# EAGLE schematic EXCISS Mainboard (EAGLE 7.7.0)

## Sheet 1 of 5
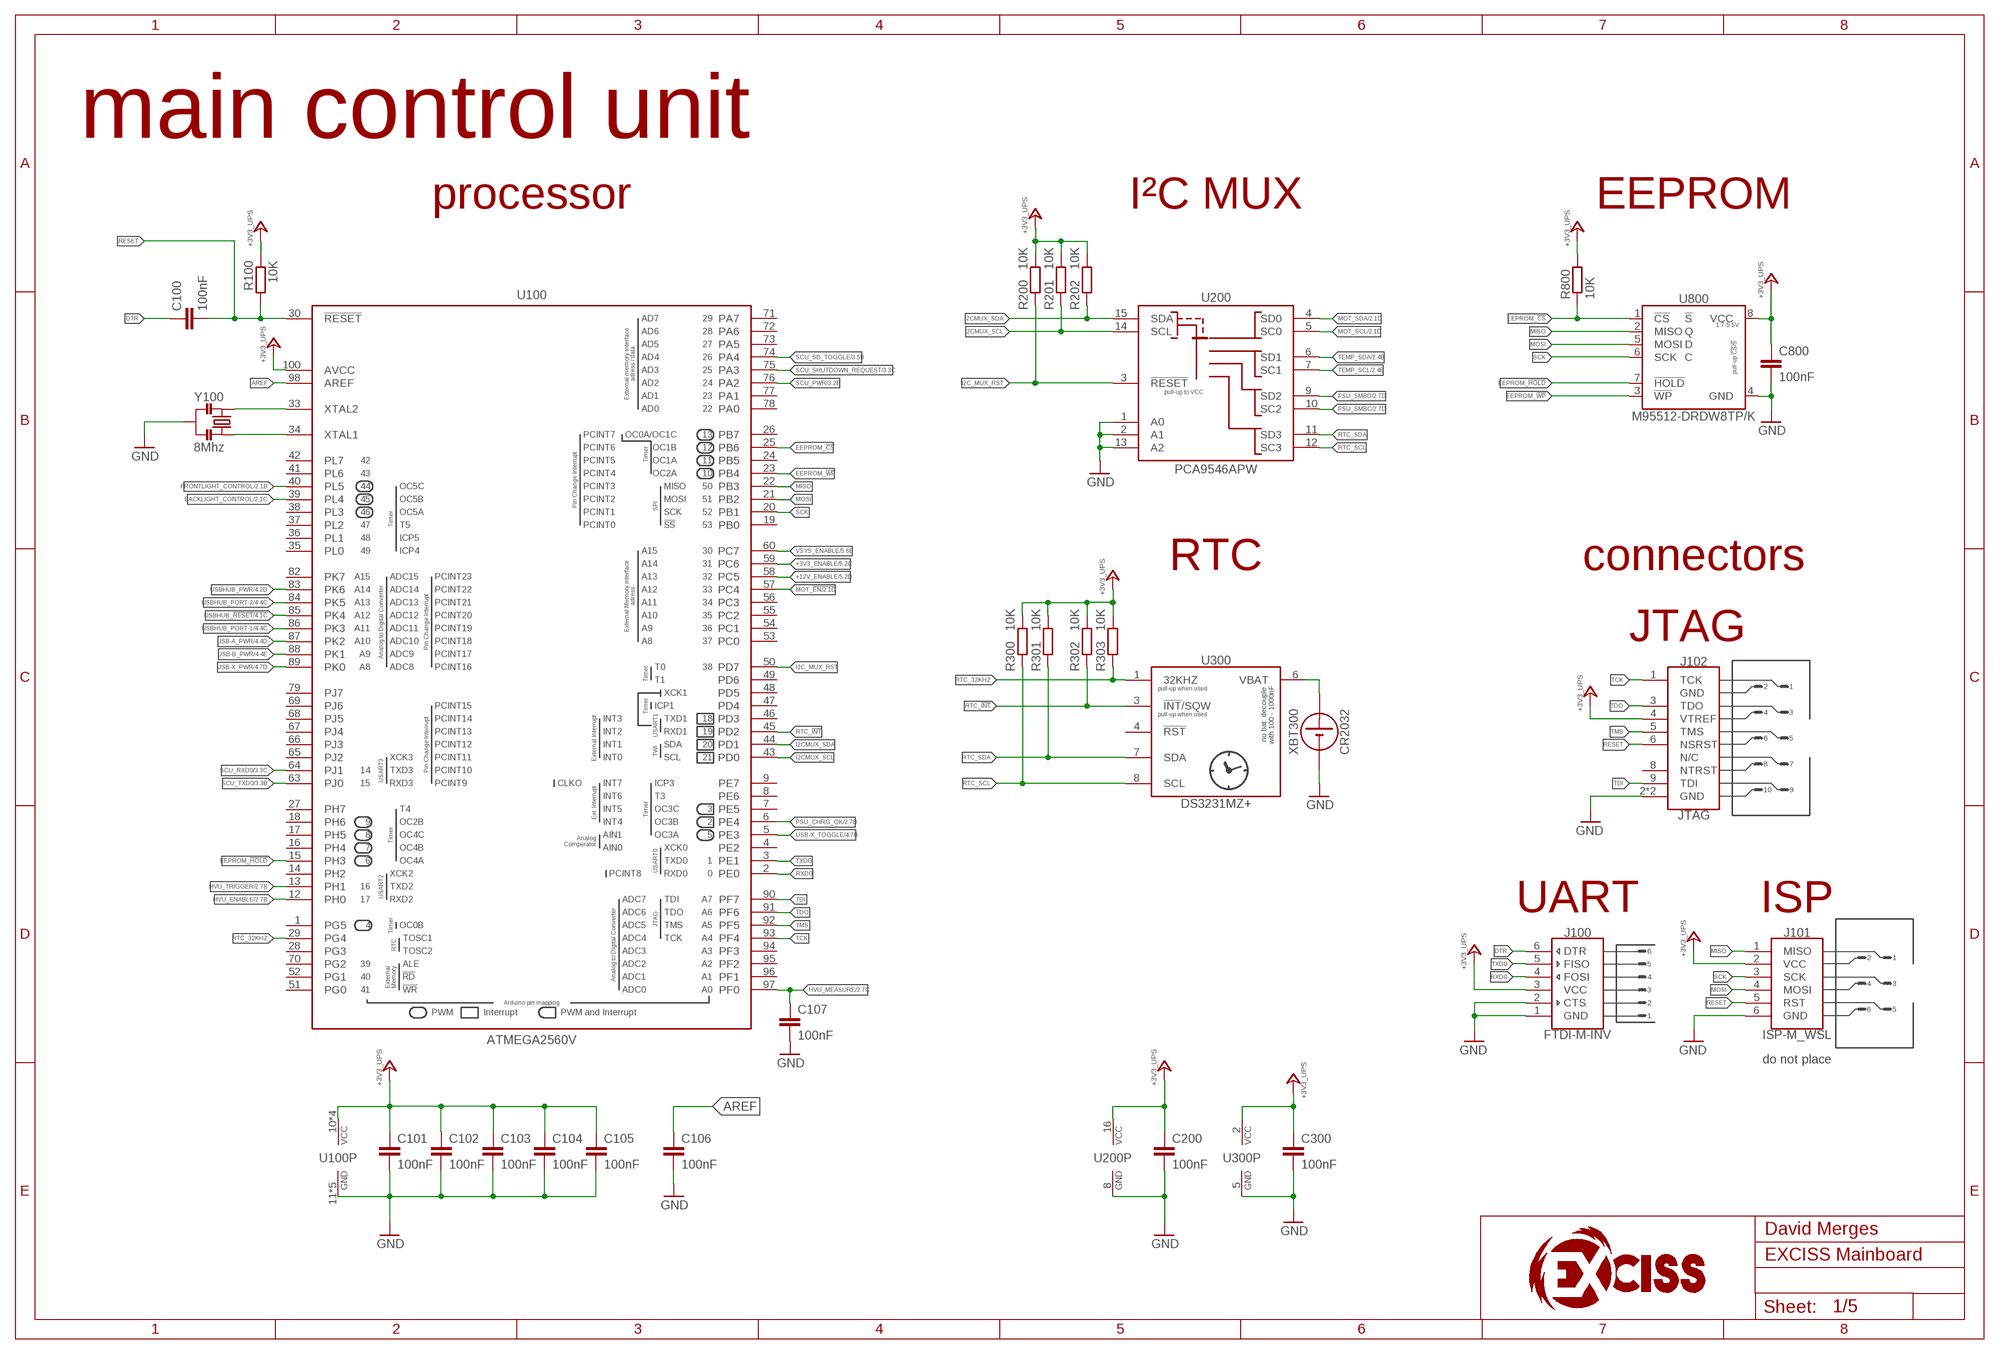
[diagram p0: schematic, sheet 1]

### Parts
C100  100nF  C-EUC0603  [C0603]
C101  100nF  C-EUC0603  [C0603]
C102  100nF  C-EUC0603  [C0603]
C103  100nF  C-EUC0603  [C0603]
C104  100nF  C-EUC0603  [C0603]
C105  100nF  C-EUC0603  [C0603]
C106  100nF  C-EUC0603  [C0603]
C107  100nF  C-EUC0603  [C0603]
C200  100nF  C-EUC0603  [C0603]
C300  100nF  C-EUC0603  [C0603]
C800  100nF  C-EUC0603  [C0603]
J100  FTDI-M-INV  [MPE_094-1-006]
J101  ISP-M_WSL  [ISP-M-THT]
J102  JTAG  [20021521-00010T1LF]
R100  10K  R-EU_R0603  [R0603]
R200  10K  R-EU_R0603  [R0603]
R201  10K  R-EU_R0603  [R0603]
R202  10K  R-EU_R0603  [R0603]
R300  10K  R-EU_R0603  [R0603]
R301  10K  R-EU_R0603  [R0603]
R302  10K  R-EU_R0603  [R0603]
R303  10K  R-EU_R0603  [R0603]
R800  10K  R-EU_R0603  [R0603]
U100  ATMEGA2560V  [TQFP100]
U200  PCA9546APW  [R-PDSO-G16]
U300  DS3231MZ+  [SOIC8]
U800  M95512-DRDW8TP/K  [TSSOP8]
XBT300  KEYSTONE_1070  [KEYSTONE_1070]
Y100  8Mhz  CSTNE8M00GH5C000R0  [CSTNE]

### Nets
+3V3_ENABLE: U100.59(PC6) ; also sheet 5
+3V3_UPS: C101.1 C102.1 C103.1 C104.1 C105.1 C200.1 C300.1 C800.1 J100.3(VCC) J101.2(VCC) J102.4(VTREF) R100.1 R200.1 R201.1 R202.1 R300.1 R301.1 R302.1 R303.1 R800.2 U100.10(VCC) U100.31(VCC) U100.61(VCC) U100.80(VCC) U100.100(AVCC) U200.16(VCC) U300.2(VCC) U800.8(VCC) ; also sheet 2,4,5
+12V_ENABLE: U100.58(PC5) ; also sheet 5
AREF: C106.1 U100.98(AREF)
BACKLIGHT_CONTROL: U100.39(PL4) ; also sheet 2
DTR: C100.1 J100.6(DTR)
EEPROM_!CS: R800.1 U100.25(PB6) U800.1(!CS)
EEPROM_!HOLD: U100.15(PH3) U800.7(!HOLD)
EEPROM_!WP: U100.23(PB4) U800.3(!WP)
FRONTLIGHT_CONTROL: U100.40(PL5) ; also sheet 2
GND: C101.2 C102.2 C103.2 C104.2 C105.2 C106.2 C107.2 C200.2 C300.2 C800.2 J100.1(GND) J100.2(CTS) J101.6(GND) J102.2(GND) J102.10(GND) U100.11(GND) U100.32(GND) U100.62(GND) U100.81(GND) U100.99(GND) U200.1(A0) U200.2(A1) U200.8(GND) U200.13(A2) U300.5(GND) U800.4(GND) XBT300.- Y100.2 ; also sheet 2,3,4,5
HVU_ENABLE: U100.12(PH0) ; also sheet 2
HVU_MEASURE: C107.1 U100.97(PF0) ; also sheet 2
HVU_TRIGGER: U100.13(PH1) ; also sheet 2
I2C_MUX_RST: R200.2 U100.50(PD7) U200.3(!RESET)
I2CMUX_SCL: R201.2 U100.43(PD0) U200.14(SCL)
I2CMUX_SDA: R202.2 U100.44(PD1) U200.15(SDA)
MISO: J101.1(MISO) U100.22(PB3) U800.2(MISO)
MOSI: J101.4(MOSI) U100.21(PB2) U800.5(MOSI)
MOT_!EN: U100.57(PC4) ; also sheet 2
MOT_SCL: U200.5(SC0) ; also sheet 2
MOT_SDA: U200.4(SD0) ; also sheet 2
N$28: U300.6(VBAT) XBT300.+
N$30: U100.33(XTAL2) Y100.1
N$31: U100.34(XTAL1) Y100.3
PSU_CHRG_OK: U100.6(PE4) ; also sheet 2
PSU_SMBC: U200.10(SC2) ; also sheet 2
PSU_SMBD: U200.9(SD2) ; also sheet 2
RESET: C100.2 J101.5(RST) J102.6(NSRST) R100.2 U100.30(!RESET!)
RTC_32KHZ: R303.2 U100.29(PG4) U300.1(32KHZ)
RTC_!INT: R302.2 U100.45(PD2) U300.3(!INT!/SQW)
RTC_SCL: R300.2 U200.12(SC3) U300.8(SCL)
RTC_SDA: R301.2 U200.11(SD3) U300.7(SDA)
RXD0: J100.4(FOSI) U100.2(PE0)
SCK: J101.3(SCK) U100.20(PB1) U800.6(SCK)
SCU_PWR: U100.76(PA2) ; also sheet 3
SCU_RXD0: U100.64(PJ1) ; also sheet 3
SCU_SD_TOGGLE: U100.74(PA4) ; also sheet 3
SCU_SHUTDOWN_REQUEST: U100.75(PA3) ; also sheet 3
SCU_TXD0: U100.63(PJ0) ; also sheet 3
TCK: J102.1(TCK) U100.93(PF4)
TDI: J102.9(TDI) U100.90(PF7)
TDO: J102.3(TDO) U100.91(PF6)
TEMP_SCL: U200.7(SC1) ; also sheet 2
TEMP_SDA: U200.6(SD1) ; also sheet 2
TMS: J102.5(TMS) U100.92(PF5)
TXD0: J100.5(FISO) U100.3(PE1)
USB-A_PWR: U100.87(PK2) ; also sheet 4
USB-B_PWR: U100.88(PK1) ; also sheet 4
USB-X_PWR: U100.89(PK0) ; also sheet 4
USB-X_TOGGLE: U100.5(PE3) ; also sheet 4
USBHUB_!RESET: U100.85(PK4) ; also sheet 4
USBHUB_PORT-1: U100.86(PK3) ; also sheet 4
USBHUB_PORT-2: U100.84(PK5) ; also sheet 4
USBHUB_PWR: U100.83(PK6) ; also sheet 4
VSYS_ENABLE: U100.60(PC7) ; also sheet 5
Unconnected: J102.8(NTRST) U100.1(PG5) U100.4(PE2) U100.7(PE5) U100.8(PE6) U100.9(PE7) U100.14(PH2) U100.16(PH4) U100.17(PH5) U100.18(PH6) U100.19(PB0) U100.24(PB5) U100.26(PB7) U100.27(PH7) U100.28(PG3) U100.35(PL0) U100.36(PL1) U100.37(PL2) U100.38(PL3) U100.41(PL6) U100.42(PL7) U100.46(PD3) U100.47(PD4) U100.48(PD5) U100.49(PD6) U100.51(PG0) U100.52(PG1) U100.53(PC0) U100.54(PC1) U100.55(PC2) U100.56(PC3) U100.65(PJ2) U100.66(PJ3) U100.67(PJ4) U100.68(PJ5) U100.69(PJ6) U100.70(PG2) U100.71(PA7) U100.72(PA6) U100.73(PA5) U100.77(PA1) U100.78(PA0) U100.79(PJ7) U100.82(PK7) U100.94(PF3) U100.95(PF2) U100.96(PF1) U300.4(!RST!)

### Notes on the sheet
- main control unit
- processor | I²C MUX | EEPROM
- RTC | connectors
- JTAG
- CR2032
- UART | ISP
- do not place

## Sheet 2 of 5
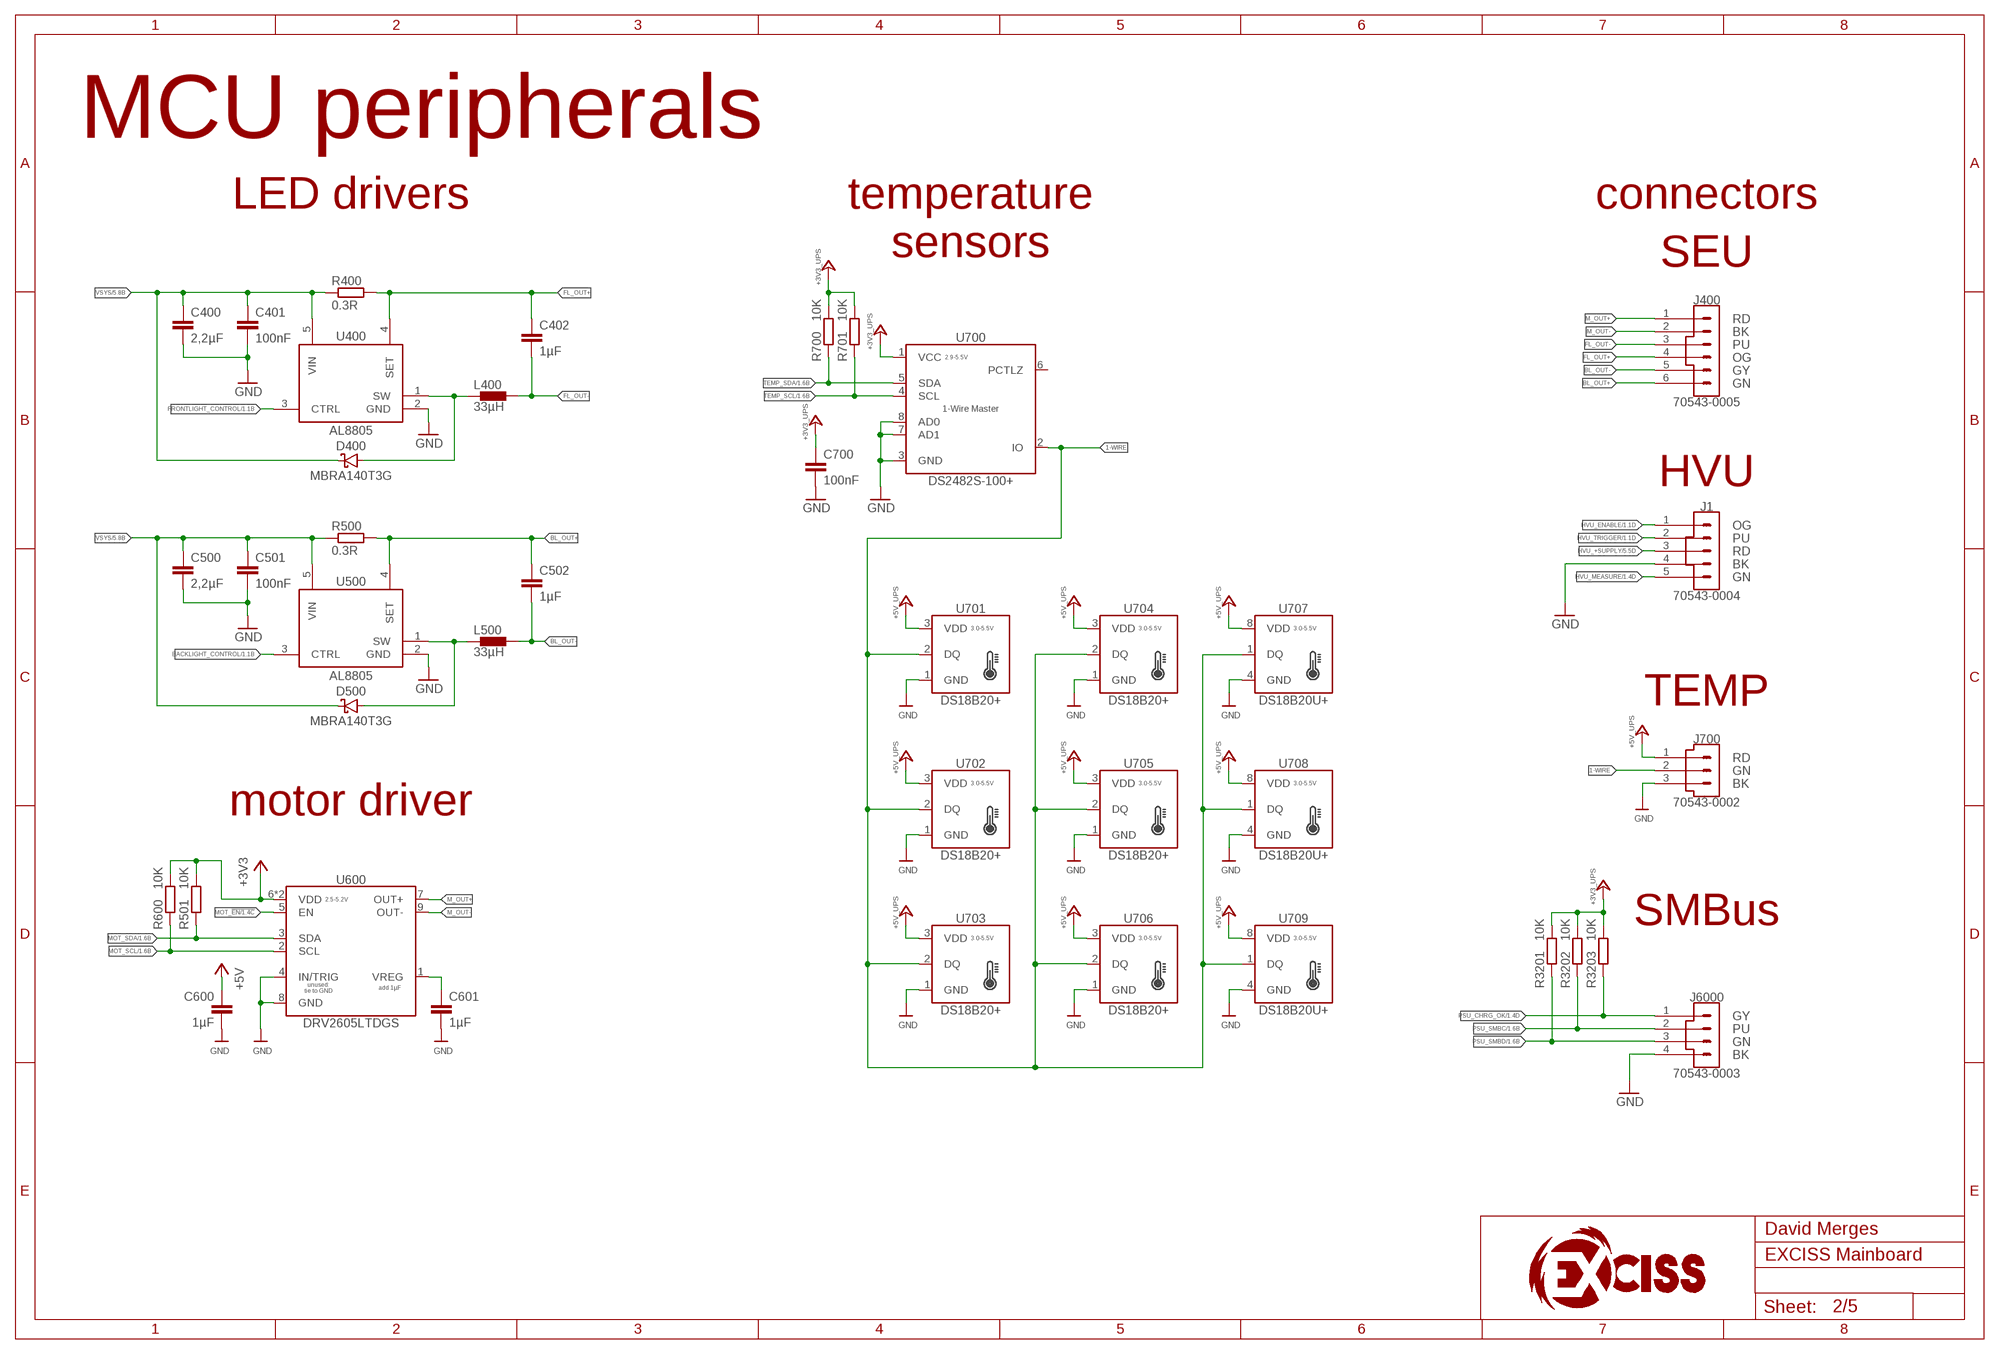
[diagram p1: schematic, sheet 2]

### Parts
C400  2,2µF  C-EUC1206  [C1206]
C401  100nF  C-EUC0805  [C0805]
C402  1µF  C-EUC0805  [C0805]
C500  2,2µF  C-EUC1206  [C1206]
C501  100nF  C-EUC0805  [C0805]
C502  1µF  C-EUC0805  [C0805]
C600  1µF  C-EUC0805  [C0805]
C601  1µF  C-EUC0805  [C0805]
C700  100nF  C-EUC0603  [C0603]
D400  MBRA140T3G  [403D-02]
D500  MBRA140T3G  [403D-02]
J1  70543-0004  [MOLEX_70543-0004]
J400  70543-0005  [MOLEX_70543-0005]
J700  70543-0002  [MOLEX_70543-0002]
J6000  70543-0003  [MOLEX_70543-0003]
L400  33µH  SRN6045-330M  [SRN6045]
L500  33µH  SRN6045-330M  [SRN6045]
R400  0.3R  R-EU_R0805  [R0805]
R500  0.3R  R-EU_R0805  [R0805]
R501  10K  R-EU_R0603  [R0603]
R600  10K  R-EU_R0603  [R0603]
R700  10K  R-EU_R0603  [R0603]
R701  10K  R-EU_R0603  [R0603]
R3201  10K  R-EU_R0603  [R0603]
R3202  10K  R-EU_R0603  [R0603]
R3203  10K  R-EU_R0603  [R0603]
U400  AL8805  [DBV(R-PDSO-G5)]
U500  AL8805  [DBV(R-PDSO-G5)]
U600  DRV2605LTDGS  [PSOP10]
U700  DS2482S-100+  [SOIC8]
U701  DS18B20+  [TO-92-STRAIGHT]
U702  DS18B20+  [TO-92-STRAIGHT]
U703  DS18B20+  [TO-92-STRAIGHT]
U704  DS18B20+  [TO-92-STRAIGHT]
U705  DS18B20+  [TO-92-STRAIGHT]
U706  DS18B20+  [TO-92-STRAIGHT]
U707  DS18B20U+  [µSOP]
U708  DS18B20U+  [µSOP]
U709  DS18B20U+  [µSOP]

### Nets
1-WIRE: J700.2 U700.2(IO) U701.2(DQ) U702.2(DQ) U703.2(DQ) U704.2(DQ) U705.2(DQ) U706.2(DQ) U707.1(DQ) U708.1(DQ) U709.1(DQ)
+3V3: C600.1 R501.1 R600.1 U600.6(VDD) U600.10(VDD) ; supply symbol labelled +5V ; also sheet 5
+3V3_UPS: C700.1 R700.1 R701.1 R3201.1 R3202.1 R3203.1 U700.1(VCC) ; also sheet 1,4,5
+5V_UPS: J700.1 U701.3(VDD) U702.3(VDD) U703.3(VDD) U704.3(VDD) U705.3(VDD) U706.3(VDD) U707.8(VDD) U708.8(VDD) U709.8(VDD) ; also sheet 3,4,5
BACKLIGHT_CONTROL: U500.3(CTRL) ; also sheet 1
BL_OUT+: C502.1 J400.6 R500.2 U500.4(SET)
BL_OUT-: C502.2 J400.5 L500.2
BL_SW: D500.A L500.1 U500.1(SW)
FL_OUT+: C402.1 J400.4 R400.2 U400.4(SET)
FL_OUT-: C402.2 J400.3 L400.2
FL_SW: D400.A L400.1 U400.1(SW)
FRONTLIGHT_CONTROL: U400.3(CTRL) ; also sheet 1
GND: C400.2 C401.2 C500.2 C501.2 C600.2 C601.2 C700.2 J1.4 J700.3 J6000.4 U400.2(GND) U500.2(GND) U600.4(IN/TRIG) U600.8(GND) U700.3(GND) U700.7(AD1) U700.8(AD0) U701.1(GND) U702.1(GND) U703.1(GND) U704.1(GND) U705.1(GND) U706.1(GND) U707.4(GND) U708.4(GND) U709.4(GND) ; also sheet 1,3,4,5
HVU_+SUPPLY: J1.3 ; also sheet 5
HVU_ENABLE: J1.1 ; also sheet 1
HVU_MEASURE: J1.5 ; also sheet 1
HVU_TRIGGER: J1.2 ; also sheet 1
M_OUT+: J400.1 U600.7(OUT+)
M_OUT-: J400.2 U600.9(OUT-)
MOT_!EN: U600.5(EN) ; also sheet 1
MOT_SCL: R600.2 U600.2(SCL) ; also sheet 1
MOT_SDA: R501.2 U600.3(SDA) ; also sheet 1
N$29: C601.1 U600.1(VREG)
PSU_CHRG_OK: J6000.1 R3203.2 ; also sheet 1
PSU_SMBC: J6000.2 R3202.2 ; also sheet 1
PSU_SMBD: J6000.3 R3201.2 ; also sheet 1
TEMP_SCL: R701.2 U700.4(SCL) ; also sheet 1
TEMP_SDA: R700.2 U700.5(SDA) ; also sheet 1
VSYS: C400.1 C401.1 C500.1 C501.1 D400.C D500.C R400.1 R500.1 U400.5(VIN) U500.5(VIN) ; also sheet 5
Unconnected: U700.6(PCTLZ)

### Notes on the sheet
- MCU peripherals
- LED drivers
- temperature
  sensors
- connectors
- SEU
- RD
- BK
- PU
- OG
- GY
- GN
- HVU
- OG
- PU
- RD
- BK
- GN
- TEMP
- RD
- GN
- motor driver | BK
- SMBus
- GY
- PU
- GN
- BK

## Sheet 3 of 5
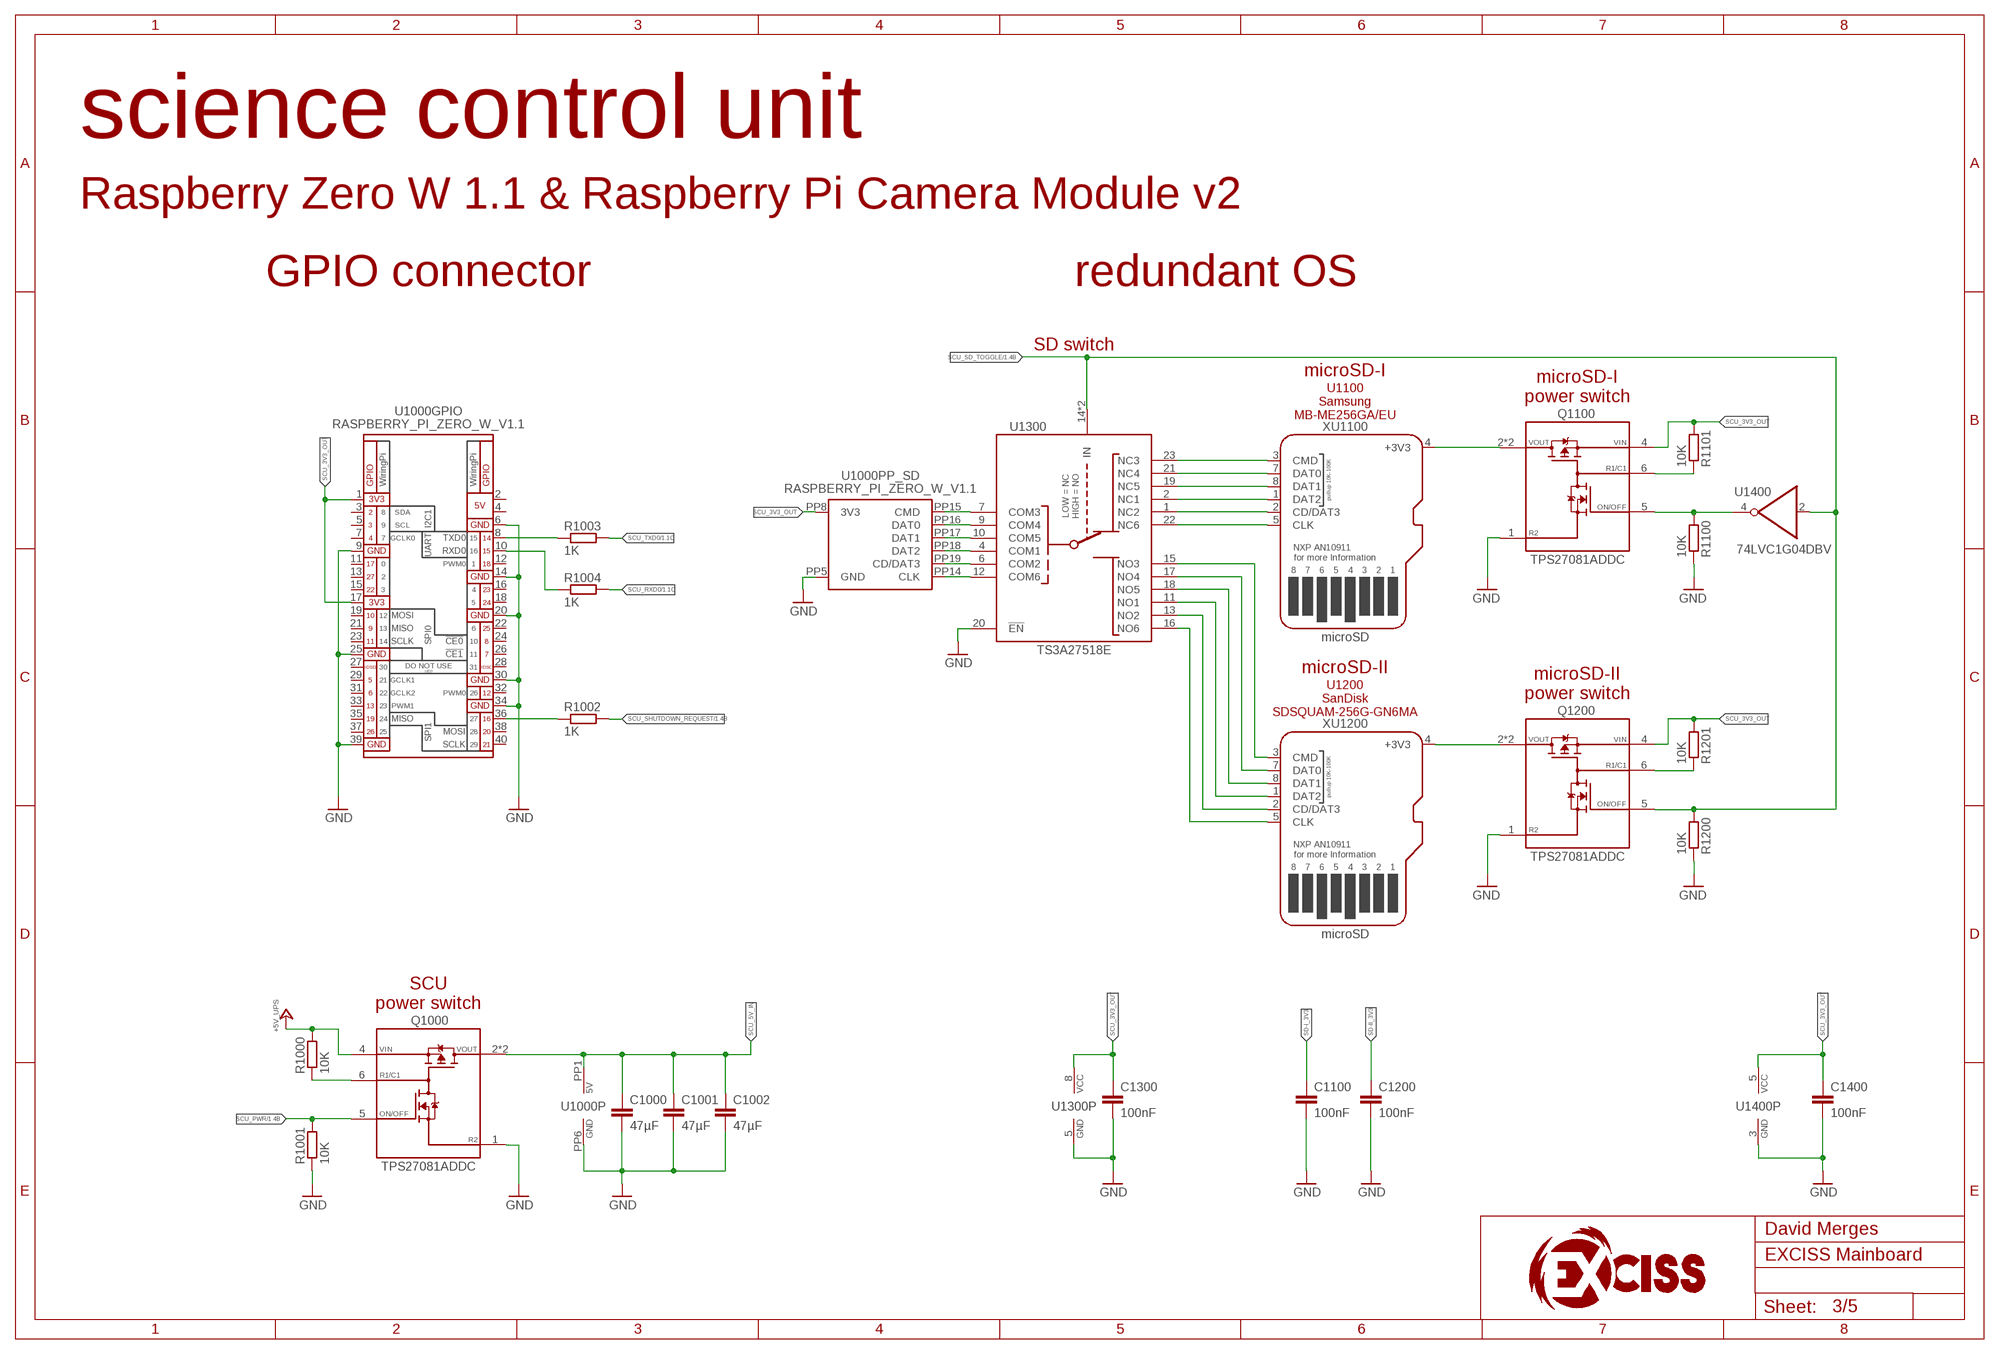
[diagram p2: schematic, sheet 3]

### Parts
C1000  47µF  C-EUC1210  [C1210]
C1001  47µF  C-EUC1210  [C1210]
C1002  47µF  C-EUC1210  [C1210]
C1100  100nF  C-EUC0603  [C0603]
C1200  100nF  C-EUC0603  [C0603]
C1300  100nF  C-EUC0603  [C0603]
C1400  100nF  C-EUC0603  [C0603]
Q1000  TPS27081ADDC  [DDC(R-PDSO-G6)]
Q1100  TPS27081ADDC  [DDC(R-PDSO-G6)]
Q1200  TPS27081ADDC  [DDC(R-PDSO-G6)]
R1000  10K  R-EU_R0603  [R0603]
R1001  10K  R-EU_R0603  [R0603]
R1002  1K  R-EU_R0603  [R0603]
R1003  1K  R-EU_R0603  [R0603]
R1004  1K  R-EU_R0603  [R0603]
R1100  10K  R-EU_R0603  [R0603]
R1101  10K  R-EU_R0603  [R0603]
R1200  10K  R-EU_R0603  [R0603]
R1201  10K  R-EU_R0603  [R0603]
U1000  RASPBERRY_PI_ZERO_W_V1.1  [RASPBERRY_PI_ZERO_W_V1.1]
U1300  TS3A27518E  [TSSOP24]
U1400  74LVC1G04DBV  [DBV(R-PDSO-G5)]
XU1100  MICROSDMOLEX_104031  [MICROSD_MOLEX_104031]
XU1200  MICROSDMOLEX_104031  [MICROSD_MOLEX_104031]

### Nets
+5V_UPS: Q1000.4(VIN) R1000.2 ; also sheet 2,4,5
GND: C1000.2 C1001.2 C1002.2 C1100.2 C1200.2 C1300.2 C1400.2 Q1000.1(R2) Q1100.1(R2) Q1200.1(R2) R1001.1 R1100.1 R1200.1 U1000.6(GPIO:GND) U1000.9(GPIO:GND) U1000.14(GPIO:GND) U1000.20(GPIO:GND) U1000.25(GPIO:GND) U1000.30(GPIO:GND) U1000.34(GPIO:GND) U1000.39(GPIO:GND) U1000.PP5(PP_SD:GND) U1000.PP6(P:GND) U1300.5(GND) U1300.20(!EN) U1400.3(GND) ; also sheet 1,2,4,5
N$1: U1000.PP15(PP_SD:CMD) U1300.7(COM3)
N$2: U1000.PP16(PP_SD:DAT0) U1300.9(COM4)
N$3: U1000.PP14(PP_SD:CLK) U1300.12(COM6)
N$4: U1000.PP19(PP_SD:CD/DAT3) U1300.6(COM2)
N$5: U1000.PP18(PP_SD:DAT2) U1300.4(COM1)
N$6: U1000.PP17(PP_SD:DAT1) U1300.10(COM5)
N$9: R1002.1 U1000.36(GPIO:GPIO16)
N$14: R1004.1 U1000.10(GPIO:GPIO15/RXD0)
N$15: R1003.1 U1000.8(GPIO:GPIO14/TXD0)
R1/C1: Q1100.6(R1/C1) R1101.1
R1/C2: Q1200.6(R1/C1) R1201.1
R1/C6: Q1000.6(R1/C1) R1000.1
SCU_3V3_OUT: C1300.1 C1400.1 Q1100.4(VIN) Q1200.4(VIN) R1101.2 R1201.2 U1000.1(GPIO:3V3) U1000.17(GPIO:3V3) U1000.PP8(PP_SD:3V3) U1300.8(VCC) U1400.5(VCC)
SCU_5V_IN: C1000.1 C1001.1 C1002.1 Q1000.2(VOUT) Q1000.3(VOUT) U1000.PP1(P:5V)
SCU_PWR: Q1000.5(ON/OFF) R1001.2 ; also sheet 1
SCU_RXD0: R1004.2 ; also sheet 1
SCU_SD_!TOGGLE: Q1100.5(ON/OFF) R1100.2 U1400.4(O)
SCU_SD_TOGGLE: Q1200.5(ON/OFF) R1200.2 U1300.14(IN) U1300.24(IN) U1400.2(I) ; also sheet 1
SCU_SHUTDOWN_REQUEST: R1002.2 ; also sheet 1
SCU_TXD0: R1003.2 ; also sheet 1
SD-1_CD/DAT3: U1300.1(NC2) XU1100.2(CD/DAT3)
SD-1_CLK: U1300.22(NC6) XU1100.5(CLK)
SD-1_CMD: U1300.23(NC3) XU1100.3(CMD)
SD-1_DAT0: U1300.21(NC4) XU1100.7(DAT0)
SD-1_DAT1: U1300.19(NC5) XU1100.8(DAT1)
SD-1_DAT2: U1300.2(NC1) XU1100.1(DAT2)
SD-2_CD/DAT3: U1300.13(NO2) XU1200.2(CD/DAT3)
SD-2_CLK: U1300.16(NO6) XU1200.5(CLK)
SD-2_CMD: U1300.15(NO3) XU1200.3(CMD)
SD-2_DAT0: U1300.17(NO4) XU1200.7(DAT0)
SD-2_DAT1: U1300.18(NO5) XU1200.8(DAT1)
SD-2_DAT2: U1300.11(NO1) XU1200.1(DAT2)
SD-I_3V3: C1100.1 Q1100.2(VOUT) Q1100.3(VOUT) XU1100.4(+3V3)
SD-II_3V3: C1200.1 Q1200.2(VOUT) Q1200.3(VOUT) XU1200.4(+3V3)
Unconnected: U1000.2(GPIO:5V) U1000.3(GPIO:GPIO2/SDA1) U1000.4(GPIO:5V) U1000.5(GPIO:GPIO3/SCL1) U1000.7(GPIO:GPIO4/GCKL) U1000.11(GPIO:GPIO17/GEN0) U1000.12(GPIO:GPIO18) U1000.13(GPIO:GPIO27/GEN2) U1000.15(GPIO:GPIO22/GEN3) U1000.16(GPIO:GPIO23/GEN4) U1000.18(GPIO:GPIO24/GEN5) U1000.19(GPIO:GPIO10/MOSI) U1000.21(GPIO:GPIO9/MISO) U1000.22(GPIO:GPIO25/GEN6) U1000.23(GPIO:GPIO11/SCLK) U1000.24(GPIO:GPIO8/!CE0!) U1000.26(GPIO:GPIO7/!CE1!) U1000.27(GPIO:ID_SD) U1000.28(GPIO:ID_SC) U1000.29(GPIO:GPIO5) U1000.31(GPIO:GPIO6) U1000.32(GPIO:GPIO12) U1000.33(GPIO:GPIO13) U1000.35(GPIO:GPIO19) U1000.37(GPIO:GPIO26) U1000.38(GPIO:GPIO20) U1000.40(GPIO:GPIO21)

### Notes on the sheet
- science control unit
- Raspberry Zero W 1.1 & Raspberry Pi Camera Module v2
- GPIO connector | redundant OS
- SD switch
- microSD-I
- U1100
  Samsung
  MB-ME256GA/EU
- microSD-I
  power switch
- microSD-II
- U1200
  SanDisk
  SDSQUAM-256G-GN6MA
- microSD-II
  power switch
- SCU
  power switch

## Sheet 4 of 5
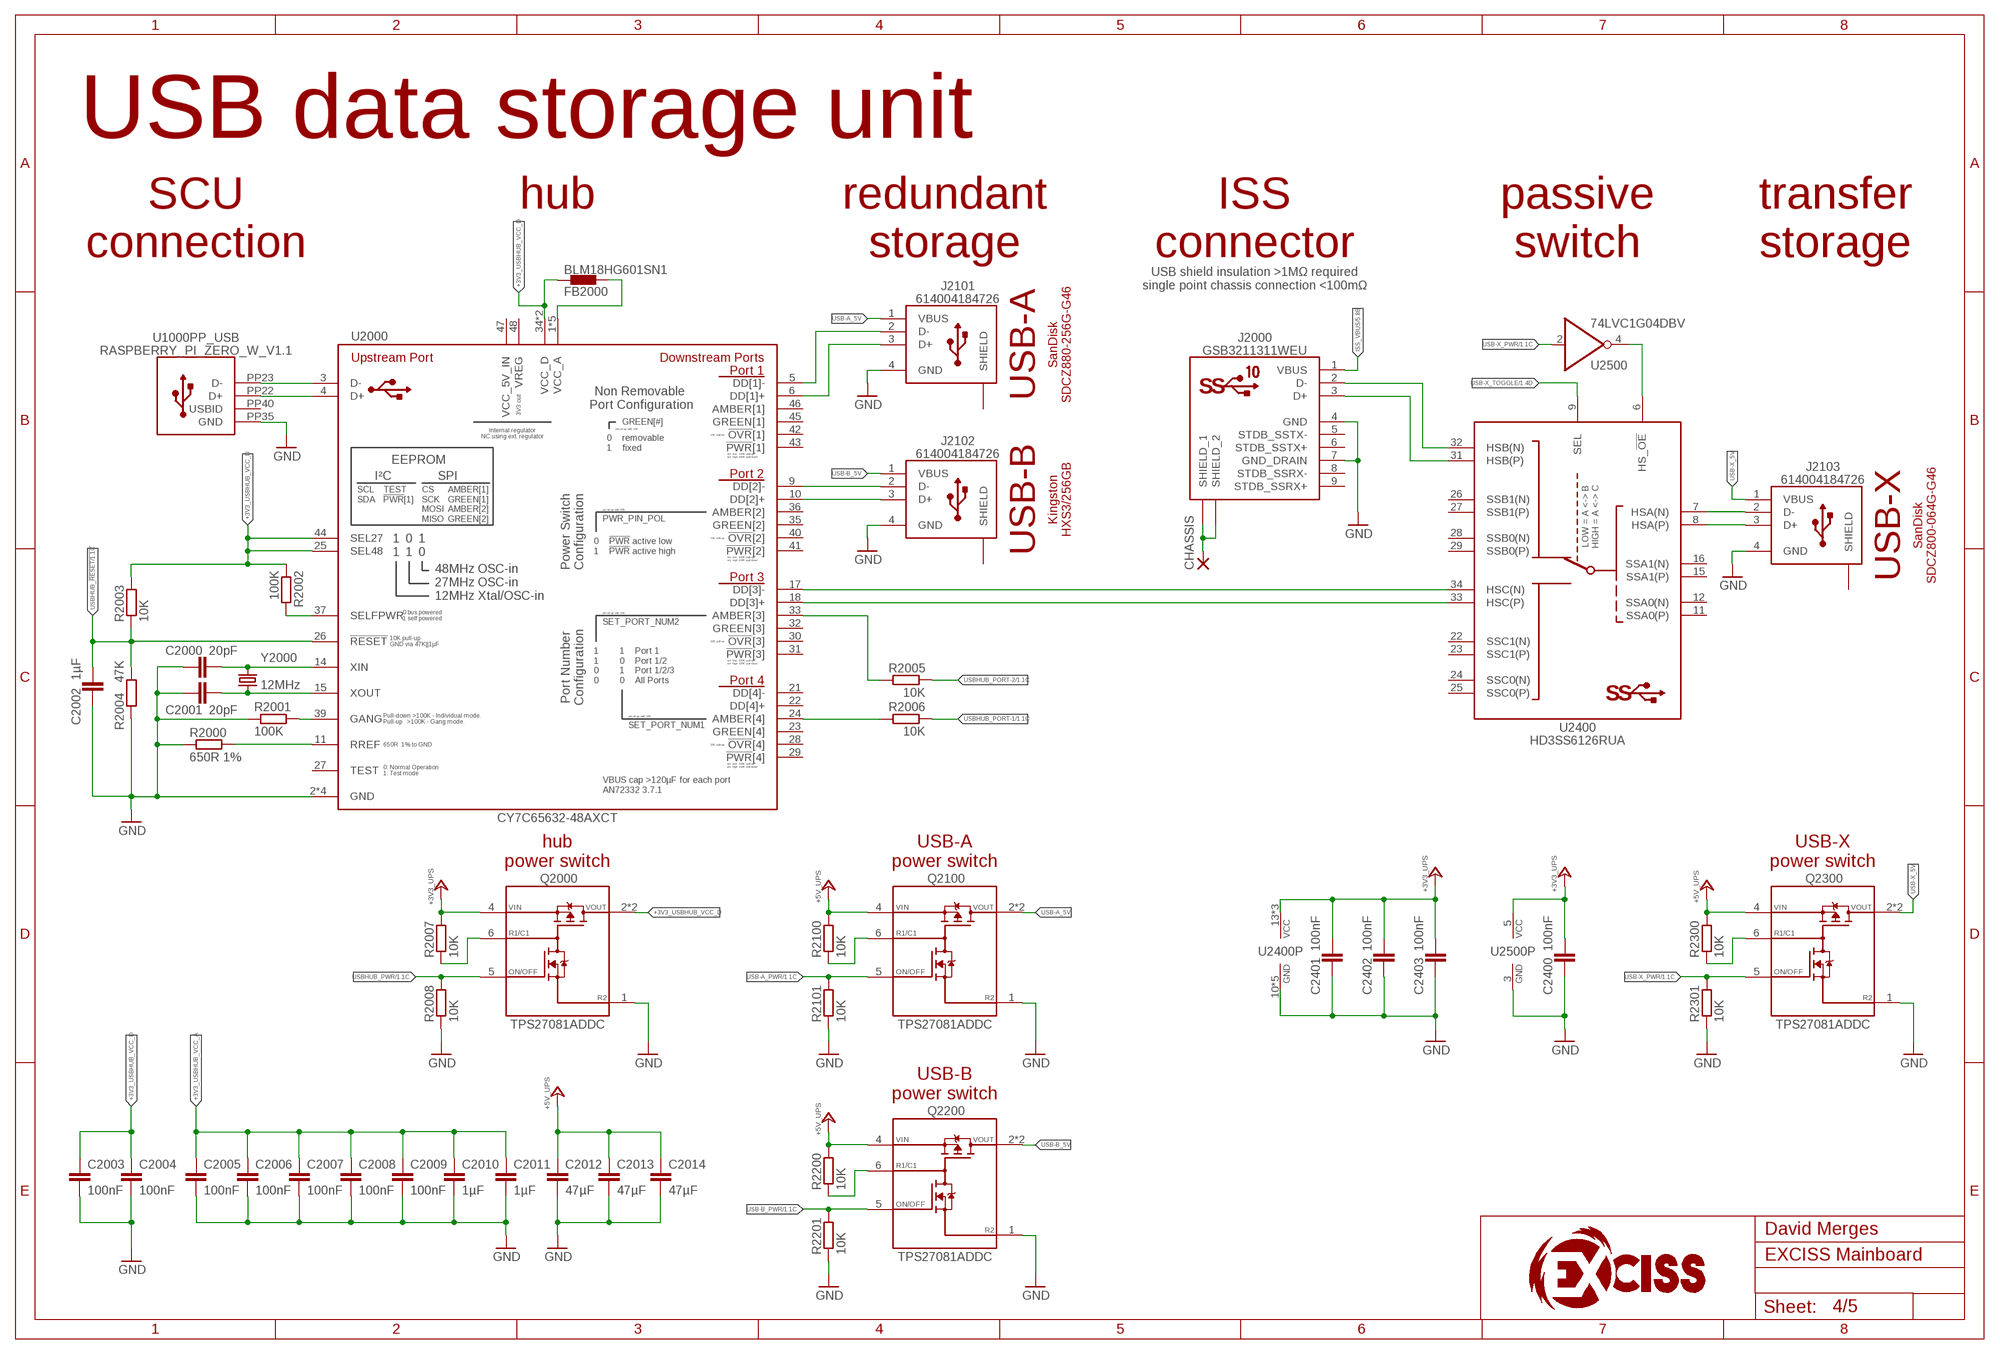
[diagram p3: schematic, sheet 4]

### Parts
C2000  20pF  C-EUC0603  [C0603]
C2001  20pF  C-EUC0603  [C0603]
C2002  1µF  C-EUC0805  [C0805]
C2003  100nF  C-EUC0603  [C0603]
C2004  100nF  C-EUC0603  [C0603]
C2005  100nF  C-EUC0603  [C0603]
C2006  100nF  C-EUC0603  [C0603]
C2007  100nF  C-EUC0603  [C0603]
C2008  100nF  C-EUC0603  [C0603]
C2009  100nF  C-EUC0603  [C0603]
C2010  1µF  C-EUC0805  [C0805]
C2011  1µF  C-EUC0805  [C0805]
C2012  47µF  C-EUC1210  [C1210]
C2013  47µF  C-EUC1210  [C1210]
C2014  47µF  C-EUC1210  [C1210]
C2400  100nF  C-EUC0603  [C0603]
C2401  100nF  C-EUC0603  [C0603]
C2402  100nF  C-EUC0603  [C0603]
C2403  100nF  C-EUC0603  [C0603]
CHASSIS  PAD_M2.5  [PAD_M2.5]
FB2000  BLM18HG601SN1  [0603]
J2000  GSB3211311WEU  [GSB3211311WEU]
J2101  614004184726  [614004184726]
J2102  614004184726  [614004184726]
J2103  614004184726  [614004184726]
Q2000  TPS27081ADDC  [DDC(R-PDSO-G6)]
Q2100  TPS27081ADDC  [DDC(R-PDSO-G6)]
Q2200  TPS27081ADDC  [DDC(R-PDSO-G6)]
Q2300  TPS27081ADDC  [DDC(R-PDSO-G6)]
R2000  650R 1%  R-EU_R0603  [R0603]
R2001  100K  R-EU_R0603  [R0603]
R2002  100K  R-EU_R0603  [R0603]
R2003  10K  R-EU_R0603  [R0603]
R2004  47K  R-EU_R0603  [R0603]
R2005  10K  R-EU_R0603  [R0603]
R2006  10K  R-EU_R0603  [R0603]
R2007  10K  R-EU_R0603  [R0603]
R2008  10K  R-EU_R0603  [R0603]
R2100  10K  R-EU_R0603  [R0603]
R2101  10K  R-EU_R0603  [R0603]
R2200  10K  R-EU_R0603  [R0603]
R2201  10K  R-EU_R0603  [R0603]
R2300  10K  R-EU_R0603  [R0603]
R2301  10K  R-EU_R0603  [R0603]
U2000  CY7C65632-48AXCT  [TQFP48]
U2400  HD3SS6126RUA  [RUA(R-PWQFN-N42)]
U2500  74LVC1G04DBV  [DBV(R-PDSO-G5)]
Y2000  12MHz  CRYSTALHC49UP  [HC49UP]

### Nets
+3V3_UPS: C2400.1 C2401.1 C2402.1 C2403.1 Q2000.4(VIN) R2007.2 U2400.13(VCC) U2400.20(VCC) U2400.30(VCC) U2500.5(VCC) ; also sheet 1,2,5
+3V3_USBHUB_VCC_A: C2005.1 C2006.1 C2007.1 C2008.1 C2009.1 C2010.1 C2011.1 FB2000.2 U2000.1(VCC_A) U2000.7(VCC_A) U2000.12(VCC_A) U2000.16(VCC_A) U2000.19(VCC_A)
+3V3_USBHUB_VCC_D: C2003.1 C2004.1 FB2000.1 Q2000.2(VOUT) Q2000.3(VOUT) R2002.1 R2003.2 U2000.25(SEL48) U2000.34(VCC_D) U2000.38(VCC_D) U2000.44(SEL27)
+5V_UPS: C2012.1 C2013.1 C2014.1 Q2100.4(VIN) Q2200.4(VIN) Q2300.4(VIN) R2100.2 R2200.2 R2300.2 ; also sheet 2,3,5
DD[1]_N [diff.pair]: J2101.2(D-) U2000.5(DD[1]-)
DD[1]_P [diff.pair]: J2101.3(D+) U2000.6(DD[1]+)
DD[2]_N [diff.pair]: J2102.2(D-) U2000.9(DD[2]-)
DD[2]_P [diff.pair]: J2102.3(D+) U2000.10(DD[2]+)
DD[3]_N [diff.pair]: U2000.17(DD[3]-) U2400.34(HSC(N))
DD[3]_P [diff.pair]: U2000.18(DD[3]+) U2400.33(HSC(P))
DU_N [diff.pair]: U1000.PP23(PP_USB:D-) U2000.3(D-)
DU_P [diff.pair]: U1000.PP22(PP_USB:D+) U2000.4(D+)
GND: C2000.2 C2001.2 C2002.2 C2003.2 C2004.2 C2005.2 C2006.2 C2007.2 C2008.2 C2009.2 C2010.2 C2011.2 C2012.2 C2013.2 C2014.2 C2400.2 C2401.2 C2402.2 C2403.2 J2000.4(GND) J2000.7(GND_DRAIN) J2101.4(GND) J2102.4(GND) J2103.4(GND) Q2000.1(R2) Q2100.1(R2) Q2200.1(R2) Q2300.1(R2) R2000.1 R2001.1 R2004.1 R2008.1 R2101.1 R2201.1 R2301.1 U1000.PP35(PP_USB:GND) U2000.2(GND) U2000.8(GND) U2000.13(GND) U2000.20(GND) U2400.10(GND) U2400.14(GND) U2400.17(GND) U2400.19(GND) U2400.21(GND) U2500.3(GND) ; also sheet 1,2,3,5
ISS_VBUS: J2000.1(VBUS) ; also sheet 5
N$16 [chassis connection]: CHASSIS.P$1(P) J2000.SHIELD_1 J2000.SHIELD_2
N$18: Q2100.6(R1/C1) R2100.1
N$19: R2001.2 U2000.39(GANG)
N$21: C2000.1 U2000.14(XIN) Y2000.1
N$22: C2001.1 U2000.15(XOUT) Y2000.2
N$23: R2006.2 U2000.24(AMBER[4])
N$24: R2005.2 U2000.33(AMBER[3])
N$25: R2000.2 U2000.11(RREF)
N$26: R2002.2 U2000.37(SELFPWR)
R1/C3: Q2000.6(R1/C1) R2007.1
R1/C4: Q2200.6(R1/C1) R2200.1
R1/C5: Q2300.6(R1/C1) R2300.1
USB-A_5V: J2101.1(VBUS) Q2100.2(VOUT) Q2100.3(VOUT)
USB-A_PWR: Q2100.5(ON/OFF) R2101.2 ; also sheet 1
USB-B_5V: J2102.1(VBUS) Q2200.2(VOUT) Q2200.3(VOUT)
USB-B_PWR: Q2200.5(ON/OFF) R2201.2 ; also sheet 1
USB-X_5V: J2103.1(VBUS) Q2300.2(VOUT) Q2300.3(VOUT)
USB-X_!PWR: U2400.6(HS_!OE) U2500.4(O)
USB-X_PWR: Q2300.5(ON/OFF) R2301.2 U2500.2(I) ; also sheet 1
USB-X_TOGGLE: U2400.9(SEL) ; also sheet 1
USBHUB_!RESET: C2002.1 R2003.1 R2004.2 U2000.26(!RESET) ; also sheet 1
USBHUB_PORT-1: R2006.1 ; also sheet 1
USBHUB_PORT-2: R2005.1 ; also sheet 1
USBHUB_PWR: Q2000.5(ON/OFF) R2008.2 ; also sheet 1
USBISS_D_N [diff.pair]: J2000.2(D-) U2400.32(HSB(N))
USBISS_D_P [diff.pair]: J2000.3(D+) U2400.31(HSB(P))
USBX_D_N [diff.pair]: J2103.2(D-) U2400.7(HSA(N))
USBX_D_P [diff.pair]: J2103.3(D+) U2400.8(HSA(P))
Unconnected: J2000.5(STDB_SSTX-) J2000.6(STDB_SSTX+) J2000.8(STDB_SSRX-) J2000.9(STDB_SSRX+) J2101.SHIELD_1(SHIELD) J2101.SHIELD_2(SHIELD) J2101.SHIELD_3(SHIELD) J2102.SHIELD_1(SHIELD) J2102.SHIELD_2(SHIELD) J2102.SHIELD_3(SHIELD) J2103.SHIELD_1(SHIELD) J2103.SHIELD_2(SHIELD) J2103.SHIELD_3(SHIELD) U1000.PP40(PP_USB:USBID) U2000.21(DD[4]-) U2000.22(DD[4]+) U2000.23(GREEN[4]) U2000.27(TEST) U2000.28(!OVR![4]) U2000.29(!PWR![4]) U2000.30(!OVR![3]) U2000.31(!PWR![3]) U2000.32(GREEN[3]) U2000.35(GREEN[2]) U2000.36(AMBER[2]) U2000.40(!OVR![2]) U2000.41(!PWR![2]) U2000.42(!OVR![1]) U2000.43(!PWR![1]) U2000.45(GREEN[1]) U2000.46(AMBER[1]) U2000.48(VREG) U2400.11(SSA0(P)) U2400.12(SSA0(N)) U2400.15(SSA1(P)) U2400.16(SSA1(N)) U2400.22(SSC1(N)) U2400.23(SSC1(P)) U2400.24(SSC0(N)) U2400.25(SSC0(P)) U2400.26(SSB1(N)) U2400.27(SSB1(P)) U2400.28(SSB0(N)) U2400.29(SSB0(P))

### Notes on the sheet
- USB data storage unit
- SCU
  connection
- hub
- redundant
  storage
- ISS
  connector
- passive
  switch
- transfer
  storage
- USB shield insulation >1MΩ required
  single point chassis connection <100mΩ
- USB-A
- SanDisk
  SDCZ880-256G-G46
- USB-B
- Kingston
  HXS3/256GB
- USB-X
- SanDisk
  SDCZ800-064G-G46
- hub
  power switch
- USB-A
  power switch
- USB-X
  power switch
- USB-B
  power switch

## Sheet 5 of 5
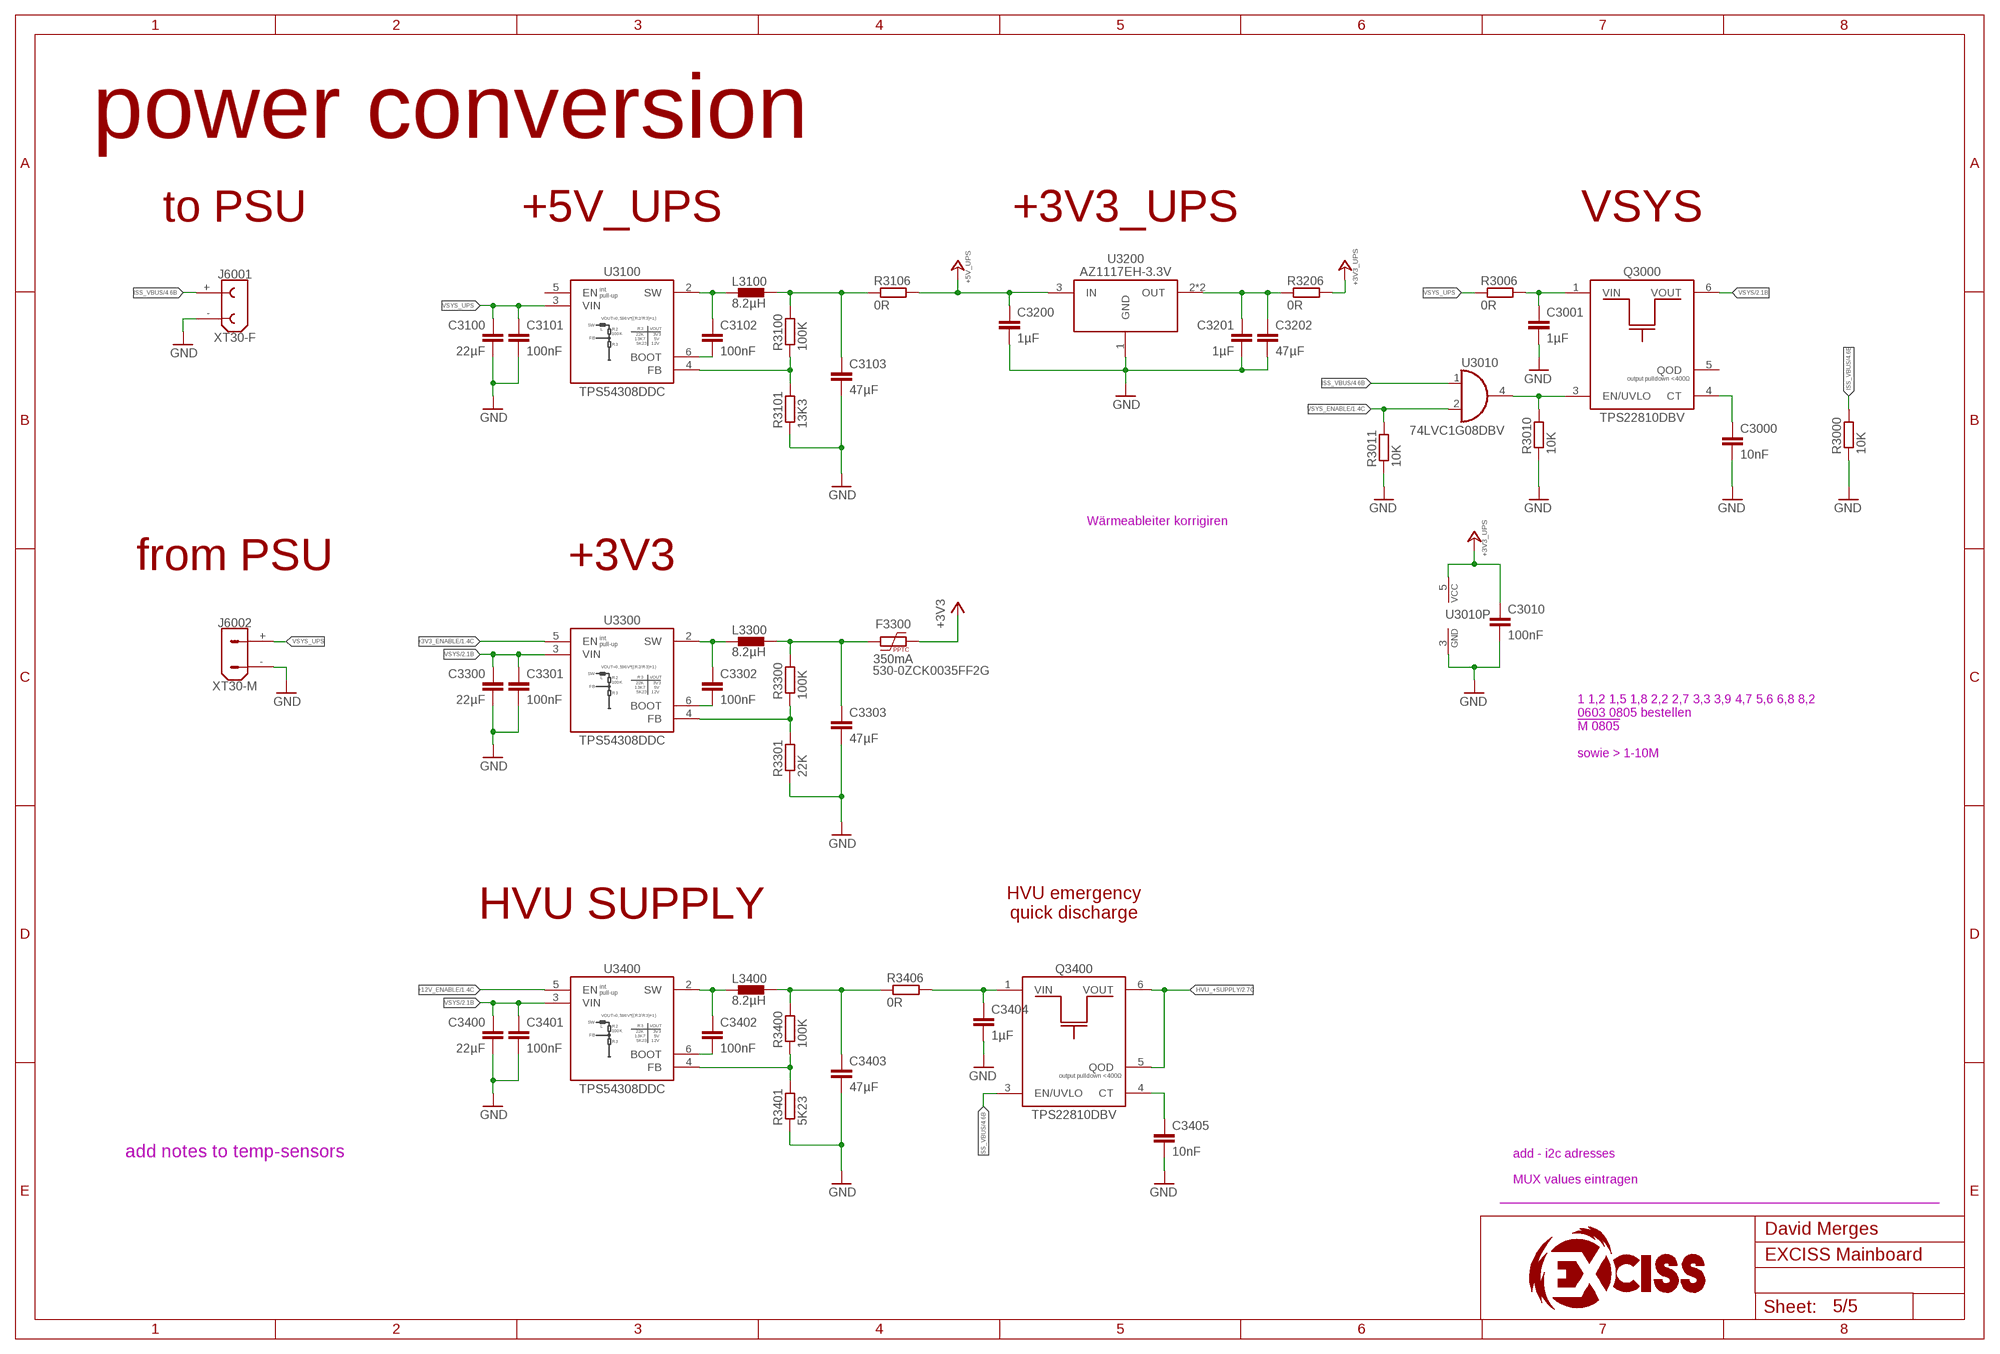
[diagram p4: schematic, sheet 5]

### Parts
C3000  10nF  C-EUC0603  [C0603]
C3001  1µF  C-EUC0805  [C0805]
C3010  100nF  C-EUC0805  [C0805]
C3100  22µF  C-EUC1206  [C1206]
C3101  100nF  C-EUC0805  [C0805]
C3102  100nF  C-EUC0805  [C0805]
C3103  47µF  C-EUC1210  [C1210]
C3200  1µF  C-EUC0805  [C0805]
C3201  1µF  C-EUC0805  [C0805]
C3202  47µF  C-EUC1210  [C1210]
C3300  22µF  C-EUC1206  [C1206]
C3301  100nF  C-EUC0805  [C0805]
C3302  100nF  C-EUC0805  [C0805]
C3303  47µF  C-EUC1210  [C1210]
C3400  22µF  C-EUC1206  [C1206]
C3401  100nF  C-EUC0805  [C0805]
C3402  100nF  C-EUC0805  [C0805]
C3403  47µF  C-EUC1210  [C1210]
C3404  1µF  C-EUC0805  [C0805]
C3405  10nF  C-EUC0603  [C0603]
F3300  350mA  PTC_FUSE0805_NOCREAM  [R0805_NOCREAM]
J6001  XT30-F  [XT30-F]
J6002  XT30-M  [XT30-M]
L3100  8.2µH  SRP6540-8R2M  [SRP6540]
L3300  8.2µH  SRP6540-8R2M  [SRP6540]
L3400  8.2µH  SRP6540-8R2M  [SRP6540]
Q3000  TPS22810DBV  [SOT23-6_DBV]
Q3400  TPS22810DBV  [SOT23-6_DBV]
R3000  10K  R-EU_R1206  [R1206]
R3006  0R  R_NOCREAM0805  [R0805_NOCREAM]
R3010  10K  R-EU_R0603  [R0603]
R3011  10K  R-EU_R0603  [R0603]
R3100  100K  R-EU_R0603  [R0603]
R3101  13K3  R-EU_R0603  [R0603]
R3106  0R  R_NOCREAM0805  [R0805_NOCREAM]
R3206  0R  R_NOCREAM0805  [R0805_NOCREAM]
R3300  100K  R-EU_R0603  [R0603]
R3301  22K  R-EU_R0603  [R0603]
R3400  100K  R-EU_R0603  [R0603]
R3401  5K23  R-EU_R0603  [R0603]
R3406  0R  R_NOCREAM0805  [R0805_NOCREAM]
U3010  74LVC1G08DBV  [SOT23-5]
U3100  TPS54308DDC  [DDC(R-PDSO-G6)]
U3200  AZ1117EH-3.3V  [SOT223]
U3300  TPS54308DDC  [DDC(R-PDSO-G6)]
U3400  TPS54308DDC  [DDC(R-PDSO-G6)]

### Nets
+3V3: F3300.2 ; also sheet 2
+3V3_ENABLE: U3300.5(EN) ; also sheet 1
+3V3_UPS: C3010.1 R3206.2 U3010.5(VCC) ; also sheet 1,2,4
+5V_UPS: C3200.1 R3106.2 U3200.3(IN) ; also sheet 2,3,4
+12V_ENABLE: U3400.5(EN) ; also sheet 1
+12V_STEPDOWN: C3403.1 L3400.2 R3400.2 R3406.1
BST_+5V: C3302.2 U3300.6(BOOT)
BST_+5V_UPS: C3102.2 U3100.6(BOOT)
BST_+12V: C3402.2 U3400.6(BOOT)
GND: C3000.2 C3001.2 C3010.2 C3100.2 C3101.2 C3103.2 C3200.2 C3201.2 C3202.2 C3300.2 C3301.2 C3303.2 C3400.2 C3401.2 C3403.2 C3404.2 C3405.2 J6001.- J6002.- R3000.1 R3010.1 R3011.1 R3101.1 R3301.1 R3401.1 U3010.3(GND) U3200.1(GND) ; also sheet 1,2,3,4
HVU_+SUPPLY: Q3400.5(QOD) Q3400.6(VOUT) ; also sheet 2
ISS_VBUS: J6001.+ Q3400.3(EN/UVLO) R3000.2 U3010.1(I0) ; also sheet 4
N$7: C3405.1 Q3400.4(CT)
N$8: C3000.1 Q3000.4(CT)
N$10: C3103.1 L3100.2 R3100.2 R3106.1
N$11: C3303.1 F3300.1 L3300.2 R3300.2
N$12: C3404.1 Q3400.1(VIN) R3406.2
N$13: C3001.1 Q3000.1(VIN) R3006.2
N$17: Q3000.3(EN/UVLO) R3010.2 U3010.4(O)
OUT: C3201.1 C3202.1 R3206.1 U3200.2(OUT) U3200.4(OUT)
SW_+5V: C3302.1 L3300.1 U3300.2(SW)
SW_+5V_UPS: C3102.1 L3100.1 U3100.2(SW)
SW_+12V: C3402.1 L3400.1 U3400.2(SW)
VFB_+5V: R3300.1 R3301.2 U3300.4(FB)
VFB_+5V_UPS: R3100.1 R3101.2 U3100.4(FB)
VFB_+12V: R3400.1 R3401.2 U3400.4(FB)
VSYS: C3300.1 C3301.1 C3400.1 C3401.1 Q3000.6(VOUT) U3300.3(VIN) U3400.3(VIN) ; also sheet 2
VSYS_ENABLE: R3011.2 U3010.2(I1) ; also sheet 1
VSYS_UPS: C3100.1 C3101.1 J6002.+ R3006.1 U3100.3(VIN)
Unconnected: Q3000.5(QOD) U3100.5(EN)

### Notes on the sheet
- power conversion
- to PSU | +5V_UPS | +3V3_UPS | VSYS
- Wärmeableiter korrigiren
- from PSU | +3V3
- 530-0ZCK0035FF2G
- 1 1,2 1,5 1,8 2,2 2,7 3,3 3,9 4,7 5,6 6,8 8,2
  0603 0805 bestellen
  !M 0805
  
  sowie > 1-10M
- HVU SUPPLY
- HVU emergency
  quick discharge
- add notes to temp-sensors
- add - i2c adresses
- MUX values eintragen

## Power pins joined to a net without a drawn wire
GND: Q3000.2(GND) Q3400.2(GND) U2400.TP0(GND) U2400.TP1(GND) U2400.TP2(GND) U2400.TP3(GND) U2400.TP4(GND) U2400.TP5(GND) U2400.TP6(GND) U2400.TP7(GND) U2400.TP8(GND) U2400.TP9(GND) U2400.TP10(GND) U2400.TP11(GND) U2400.TP12(GND) U2400.TP13(GND) U2400.TP14(GND) U3100.1(GND) U3300.1(GND) U3400.1(GND) XU1100.6(GND) XU1100.G1(GND) XU1100.G2(GND) XU1100.G3(GND) XU1100.G4(GND) XU1200.6(GND) XU1200.G1(GND) XU1200.G2(GND) XU1200.G3(GND) XU1200.G4(GND)
VCC_5V_IN: U2000.47(VCC_5V_IN)

## Library data of the parts
C100-C107 C200 C300 C400-C402 C500-C502 C600 C601 C700 C800 C1000-C1002 C1100 C1200 C1300 C1400 C2000-C2014 C2400-C2403 C3000 C3001 C3010 C3100-C3103 C3200-C3202 C3300-C3303 C3400-C3405 = rcl:C-EU: CAPACITOR, European symbol
CHASSIS = exciss:PAD_M2.5: THROUGH-HOLE PAD
D400 D500 = exciss:MBRA140T3G: MBRA140T3G Surface Mount Schottky Power Rectifier Links Datasheet <http://www.onsemi.com/pub/Collateral/MBRA140T3-D.PDF> Product website <http://www.onsemi.com/PowerSolutions/product.do?id=MBRA140>; OC_MOUSER: 863-MBRA140T3G
F3300 = exciss:PTC_FUSE
FB2000 = exciss:BLM18H: BLM18K Power Lines Type Chip Ferrite Bead Links Datasheet <https://www.murata.com/~/media/webrenewal/support/library/catalog/products/emc/emifil/c31e.ashx?la=en-gb> Product website <https://www.murata.com/en-eu/products/emc/emifil/bl>; I: 1300mA; OC_MOUSER: 81-BLM11HA601SG; R100MHZ: 600
J1 = exciss:70543-0004: 70543-0004 2.54mm Pitch SL Header, Single Row, Vertical, 3.05mm Pocket, Shrouded, 6 Circuits, 0.38µm Gold (Au) Selective Plating, Tin (Sn) PC Tail Plating Links Datasheet <http://www.molex.com/pdm_docs/sd/705430005_sd.pdf> Product website <https://www.molex.com/molex/products/datasheet.jsp?part=active/0705430005_PCB_HEADERS.xmll>; OC_MOUSER: 538-70543-0003
J100 = exciss:FTDI-M
J101 = exciss:ISP-M
J102 = exciss:JTAG; OC_MOUSER: 649-200215210010T1LF
J400 = exciss:70543-0005: 70543-0005 2.54mm Pitch SL Header, Single Row, Vertical, 3.05mm Pocket, Shrouded, 7 Circuits, 0.38µm Gold (Au) Selective Plating, Tin (Sn) PC Tail Plating Links Datasheet <http://www.molex.com/pdm_docs/sd/705430006_sd.pdf> Product website <https://www.molex.com/molex/products/datasheet.jsp?part=active/0705430006_PCB_HEADERS.xml>; OC_MOUSER: 538-70543-0003
J700 = exciss:70543-0002: 70543-0002 2.54mm Pitch SL Header, Single Row, Vertical, 3.05mm Pocket, Shrouded, 4 Circuits, 0.38µm Gold (Au) Selective Plating, Tin (Sn) PC Tail Plating Links Datasheet <http://www.molex.com/pdm_docs/sd/705430003_sd.pdf> Product website <https://www.molex.com/molex/products/datasheet.jsp?part=active/0705430003_PCB_HEADERS.xml>; OC_MOUSER: 538-70543-0003
J2000 = exciss:GSB3211311WEU: GSB3211311WEU USB-Stecker USB 3.0 Type B Recpt R/A Thru Hole Blue Links Datasheet <http://www.mouser.com/ds/2/18/N1005004435-515678.pdf>; OC_MOUSER: 523-GSB3211311WEU
J2101-J2103 = exciss:614004184726: 614004184726 USB-Stecker WR-COM USB Type A THT UpRight Short Links Product Drawing <http://katalog.we-online.de/em/datasheet/614004184726.pdf> Product Website <http://katalog.we-online.de/de/em/COM_THT_TYPE_A_UP_RIGHT>
J6000 = exciss:70543-0003: 70543-0003 2.54mm Pitch SL Header, Single Row, Vertical, 3.05mm Pocket, Shrouded, 5 Circuits, 0.38µm Gold (Au) Selective Plating, Tin (Sn) PC Tail Plating Links Datasheet <http://www.molex.com/pdm_docs/sd/705430004_sd.pdf> Product website <https://www.molex.com/molex/products/datasheet.jsp?part=active/0705430004_PCB_HEADERS.xml>; OC_MOUSER: 538-70543-0004
J6001 = exciss:XT30-F
J6002 = exciss:XT30-M
L400 L500 = exciss:SRN6045: SRN6045 Series Semi-shielded Power Inductors Links Datasheet <https://www.bourns.com/docs/Product-Datasheets/SRN6045.pdf>; OC_MOUSER: 652-SRN6045-330M; TOL: 20%
L3100 L3300 L3400 = exciss:SRP6540: SRP6540 Series Shielded Power Inductors Links Datasheet <https://www.bourns.com/docs/Product-Datasheets/SRP6540.pdf>; OC_MOUSER: 652-SRP6540-8R2M; TOL: 20%
Q1000 Q1100 Q1200 Q2000 Q2100 Q2200 Q2300 = exciss:TPS27081A: TPS27081A 1.2V - 8V, 3A PFET High Side Load Switch w/ Level Shift & Adj Slew Rate Control Features Low ON-Resistance, High-Current PFET RDS(on) = 32 mΩ at VGS = –4.5 V RDS(on) = 44 mΩ at VGS = –3 V RDS(on) = 82 mΩ at VGS = –1.8 V RDS(on) = 93 mΩ at VGS = –1.5 V RDS(on) = 155 mΩ at VGS = –1.2 V Adjustable Turnon and Turnoff Slew Rate Control Through External R1, R2, and C1 Supports a Wide Range of 1.2-V to 8-V Supply Inputs Integrated NMOS for PFET Control NMOS ON/OFF Supports a Wide Range of 1-V to 8-V Control Logic Interface Full ESD Protection (All Pins) HBM 2 kV, CDM 500 V Ultra-Low Leakage Current in Standby (Typical 100 nA) Available in Tiny 6-Pin Package 2.9 mm × 2.8 mm × 0.75 mm SOT (DDC) Links Datasheet <http://www.ti.com/lit/gpn/tps27081a> Product website <http://www.ti.com/product/tps27081a>; OC_MOUSER: 595-TPS27081ADDCR
Q3000 Q3400 = exciss:TPS22810: TPS22810 18V, 3A, 79mΩ Load Switch with Adjustable Rise Time, Adj. Quick Output Discharge, & Thermal Shutdown Links Datasheet <http://www.ti.com/lit/gpn/tps22810> Product website <http://www.ti.com/product/tps22810>; OC_MOUSER: 595-TPS22810DBV
R100 R200-R202 R300-R303 R400 R500 R501 R600 R700 R701 R800 R1000-R1004 R1100 R1101 R1200 R1201 R2000-R2008 R2100 R2101 R2200 R2201 R2300 R2301 R3000 R3010 R3011 R3100 R3101 R3201-R3203 R3300 R3301 R3400 R3401 = rcl:R-EU_: RESISTOR, European symbol
R3006 R3106 R3206 R3406 = exciss:R_NOCREAM
U100 = exciss:ATMEGA2560: ATmega2560 256 KB Program Memory 16 MIPS CPU Speed 8 KB RAM 4 KB Data EEPROM Digital Communication Peripherals 4-UART 5-SPI 1-I2C Capture/Compare/PWM Peripherals 4 Input Capture 4 CCP 16PWM Timers 2 x 8-bit 4 x 16-bit 1 Comparator -40°C to 85°C Temperature Range 1.8V to 5.5V Operating Voltage Range Links Datasheet <http://ww1.microchip.com/downloads/en/DeviceDoc/Atmel-2549-8-bit-AVR-Microcontroller-ATmega640-1280-1281-2560-2561_datasheet.pdf> Product website <https://www.microchip.com/wwwproducts/en/ATmega2560>; OC_MOUSER: ATMEGA2560V-8AUR
U200 = exciss:PCA9546A: PCA9546A Low Voltage 4-Channel I²C and SMBus Switch with Reset Function Links Datasheet <http://www.ti.com/lit/ds/symlink/pca9546a.pdf> Product website <http://www.ti.com/product/PCA9546A>; OC_MOUSER: 771-PCA9546APW-T
U300 = exciss:DS3231: DS3231M ±5ppm, I2C Real-Time Clock Industry's First Temperature-Compensated RTC with Internal MEMS Resonator Reduces Crystal Mechanical Failure Susceptibility Links Datasheet <https://www.maximintegrated.com/en/products/digital/real-time-clocks/DS3231M.html#modalDatasheet> Product website <https://www.maximintegrated.com/en/products/digital/real-time-clocks/DS3231M.html>; OC_MOUSER: 700-DS3231MZ+
U400 U500 = exciss:AL8805: AL8805 Step-down constant current LED driver Links Datasheet <https://www.diodes.com/assets/Datasheets/AL8805.pdf> Product website <https://www.diodes.com/products/power-management/led-drivers/medium-voltage-dc-dc-led-drivers/part/AL8805>; OC_MOUSER: 621-AL8805W5-7
U600 = exciss:DRV2605L: DRV2605L Haptic Driver for ERM and LRA with Built-In Library and Smart Loop Architecture Links Datasheet <http://www.ti.com/lit/ds/symlink/drv2605l.pdf> Product website <http://www.ti.com/product/DRV2605L/description> DRV2605L-Q1 Haptic Driver for ERM and LRA with Built-In Library and Smart Loop Architecture Links Datasheet <http://www.ti.com/lit/gpn/drv2605l-q1> Product website <http://www.ti.com/product/drv2605l-q1/description>; OC_MOUSER: 595-DRV2605LTDGSRQ1
U700 = exciss:DS2482S-100+: DS2482S-100+ Single-Channel 1-Wire Master Links Datasheet <https://datasheets.maximintegrated.com/en/ds/DS2482-100.pdf> Product website <https://www.maximintegrated.com/en/products/interface/controllers-expanders/DS2482-100.html>; OC_MOUSER: 700-DS2482S-100
U701-U706 = exciss:DS18B20: DS18B20 Programmable Resolution 1-Wire Digital Thermometer Links Datasheet <https://datasheets.maximintegrated.com/en/ds/DS18B20.pdf> Product website <https://www.maximintegrated.com/en/products/analog/sensors-and-sensor-interface/DS18B20.html>; OC_MOUSER: 700-DS18B20+
U707-U709 = exciss:DS18B20: DS18B20 Programmable Resolution 1-Wire Digital Thermometer Links Datasheet <https://datasheets.maximintegrated.com/en/ds/DS18B20.pdf> Product website <https://www.maximintegrated.com/en/products/analog/sensors-and-sensor-interface/DS18B20.html>
U800 = exciss:M95512-DR: M95512-DRE 512-Kbit serial SPI bus EEPROM with high speed clock 105°C operation Links Datasheet <http://www.st.com/resource/en/datasheet/m95512-dre.pdf> Product website <http://www.st.com/en/memories/m95512-dre.html>
U1000 = exciss:RASPBERRY_PI_ZERO_W_V1.1: Raspberry Pi Zero W The Raspberry Pi Zero W extends the Pi Zero family and comes with added wireless LAN and Bluetooth connectivity. Links GPIO Pinout guide <https://pinout.xyz/> Product website <https://www.raspberrypi.org/products/raspberry-pi-zero-w/> Connectors needed: Power & SD: 0906-4-15-20-75-14-11-0 USB data: 0985-0-15-20-71-14-11-0 GPIO: BL 1X20G 2,54 Reichelt
U1300 = exciss:TS3A27518E: TS3A27518E 6-Bit, 1-of-2 Mux/Demux with 240 MHz Bandwidth Links Datasheet <http://www.ti.com/lit/gpn/ts3a27518e> Product website <http://www.ti.com/product/TS3A27518E>; OC_MOUSER: 595-TS3A27518EIPWRQ1
U1400 U2500 = exciss:74*1G04: SN74LVC1G04 Single Inverter Links Datasheet <http://www.ti.com/lit/ds/symlink/sn74lvc1g04.pdf> Product website <http://www.ti.com/product/SN74LVC1G04>; OC_MOUSER: 595-SN74LVC1G04DBVR
U2000 = exciss:CY7C65632: CY7C65632-48AXCT Very Low Power USB 2.0 Hub Controller Links Datasheet <http://www.cypress.com/file/114101/download> Guidelines on System Design using Cypress's USB 2.0 Hub <http://www.cypress.com/?rID=54780> Product website <http://www.cypress.com/part/cy7c65632-48axct>; OC_MOUSER: 727-CY7C65632-48AXCT
U2400 = exciss:HD3SS6126: HD3SS6126RUAR USB 3.0 + USB2.0 Differential Switch 2:1/1:2 MUX/DEMUX Links Datasheet <http://www.ti.com/lit/gpn/hd3ss6126> Product website <http://www.ti.com/product/HD3SS6126> Features Signal Switch for USB 3.0 (SuperSpeed USB and USB 2.0 HS/FS/LS) Three Bidirectional Differential Pair Channel MUX/DEMUX Switches Also Suitable for DisplayPort, PCIe Gen1/2/3, SATA 1.5/3/6G, SAS 1.5/3/6G and XAUI Applications Supports Data Rates up to 10 Gbps on High- Bandwidth Path (SS) VCC Operating Range 3.3 V ± 10% Wide –3-dB Differential BW of More Than 10 GHz on High-Bandwidth Path (SS) Uses a Unique Adaptation Method to Maintain a Constant Channel Impedance Over the Supported Common-Mode Voltage Range Excellent High-bandwidth Path Dynamic Characteristics (at 2.5 GHz) Crosstalk = –35 dB Isolation = –23 dB Insertion Loss = –1.1 dB Return Loss = –11 dB Small 3.5 mm × 9 mm, 42-Pin WQFN Package (RUA) Active Mode Power = 8 mW; OC_MOUSER: 595-HD3SS6126RUAR
U3010 = 74xx-little-de:74*1G08: 2-input AND gate
U3100 U3300 U3400 = exciss:TPS54308: TPS54308 4.5V to 28V Input, 3A Output, Synchronous 350kHz FCCM Step-Down Converter Links Datasheet <http://www.ti.com/lit/gpn/tps54308> Product website <http://www.ti.com/product/TPS54308>; OC_MOUSER: 595-TPS54308DDC
U3200 = exciss:AZ1117EH: AZ1117E low dropout three-terminal regulator with 1.0A Links Datasheet <https://www.diodes.com/assets/Datasheets/AZ1117E.pdf> Product website <https://www.diodes.com/products/power-management/low-dropout-regulators/single-ldos/part/AZ1117E>; OC_MOUSER: 621-AZ1117EH-3.3TRG1
XBT300 = exciss:KEYSTONE_1070: Keystone 1070 SMT (Auto-In/EZ-Out) Holder for 2032 Cell P/N 1070 Links Datasheet <http://www.keyelco.com/product-pdf.cfm?p=14017> Product website <http://www.keyelco.com/product.cfm/product_id/14017>; OC_MOUSER: 534-1070
XU1100 XU1200 = exciss:MICROSD: 104031-0811 1.10mm Pitch microSD Memory Card Connector, Surface Mount, Push-Pull Type, 1.42mm Height, with Detect Switch Links Datasheet <http://www.molex.com/pdm_docs/sd/740991003_sd.pdf> Product website <http://www.molex.com/molex/products/datasheet.jsp?part=active/1040310811_MEMORY_CARD_SOCKET.xml>; OC_MOUSER: 538-104031-0811
Y100 = exciss:CSTNE: CSTNE Ceramic Resonator Built in Capacitor Links Part Numbering <https://www.murata.com/en-us/products/productdata/8796821913630/L0430E.pdf> Datasheet <https://www.murata.com/en-global/products/productdata/8801161773086/SPEC-CSTNE8M00GH5C000R0.pdf?1519875007000> Product website <HTTPS_LINK>; LOAD_CAPACITY: 33pF; OC_MOUSER: 81-CSTNE8M00GH5C000R
Y2000 = exciss:CRYSTAL: CRYSTAL; OC_MOUSER: 711-VXB2-1B1-12M000; OC_REICHELT: 12,0000-HC49-SMD

## Net classes
1 diff.pair: width 0.34 mm, clearance 1 mm to class 0, clearance 0.15 mm
2 chassis connection: clearance 1 mm